# EAGLE schematic oil water separator2 (EAGLE 7.5.0)
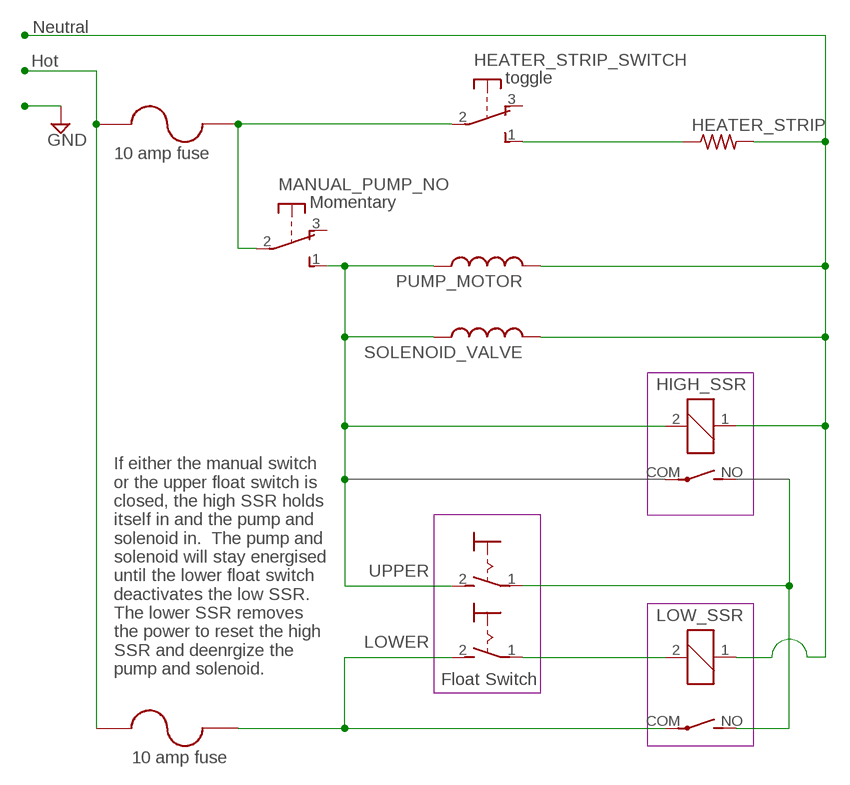
[diagram p0: schematic, sheet 1]

## Parts
HEATER_STRIP  RESISITOR0309/V  [0309V]
HEATER_STRIP_SWITCH  toggle  9077-1  [9077-1]
HIGH_SSR  APF30212A  [APF30212A]
LOW_SSR  APF30212A  [APF30212A]
LOWER  MS243  [MS243]
MANUAL_PUMP_NO  Momentary  9077-1  [9077-1]
PUMP_MOTOR  INDUCTOR0204/5  [0204/5]
SOLENOID_VALVE  INDUCTOR0204/5  [0204/5]
U$1  FUSE(SM)  [FUSE]
U$2  FUSE(SM)  [FUSE]
UPPER  MS243  [MS243]

## Nets
N$1: HEATER_STRIP.2 HIGH_SSR.1 LOW_SSR.1 PUMP_MOTOR.2 SOLENOID_VALVE.2
N$2: U$1.P$1 U$2.P$1
N$3: LOW_SSR.NO(2:S) UPPER.1(P)
N$4: HEATER_STRIP_SWITCH.2(P) MANUAL_PUMP_NO.2(P) U$1.P$2
N$5: HEATER_STRIP.1 HEATER_STRIP_SWITCH.1(S)
N$6: LOW_SSR.2 LOWER.1(P)
N$7: LOW_SSR.COM(2:P) LOWER.2(S) U$2.P$2
N$9: HIGH_SSR.2 MANUAL_PUMP_NO.1(S) PUMP_MOTOR.1 SOLENOID_VALVE.1 UPPER.2(S)
Unconnected: HEATER_STRIP_SWITCH.3(O) HIGH_SSR.COM(2:P) HIGH_SSR.NO(2:S) MANUAL_PUMP_NO.3(O)

## Notes on the sheet
- Neutral
- Hot
- 10 amp fuse
- If either the manual switch
  or the upper float switch is
  closed, the high SSR holds
  itself in and the pump and
  solenoid in.  The pump and 
  solenoid will stay energised
  until the lower float switch
  deactivates the low SSR.
  The lower SSR removes 
  the power to reset the high
  SSR and deenrgize the
  pump and solenoid.
- Float Switch
- 10 amp fuse

## Library data of the parts
HEATER_STRIP = 1 Dan's Common Parts:RESISITOR: RESISTOR, American symbol
HEATER_STRIP_SWITCH MANUAL_PUMP_NO = switch-misc:9077-1: MARQUARDT SWITCH 9077.0100 Distributor: Buerklin <https://www.buerklin.com/default.asp?event=ShowArtikel%2812G2820%29&l=d&jump=ArtNr_12G2820>
HIGH_SSR LOW_SSR = relay:APF30212A: Compliant with European standards 1a/1c 6A Slim power relays Source: Data sheet <http://pewa.panasonic.com/assets/pcsd/catalog/pf-catalog.pdf>; OC_FARNELL: unknown
LOWER UPPER = switch:MS243: TOGGLE SWITCH
PUMP_MOTOR SOLENOID_VALVE = 1 Dan's Common Parts:INDUCTOR: INDUCTOR, American symbol
U$1 U$2 = 1 Dan's Common Parts:FUSE(SM)